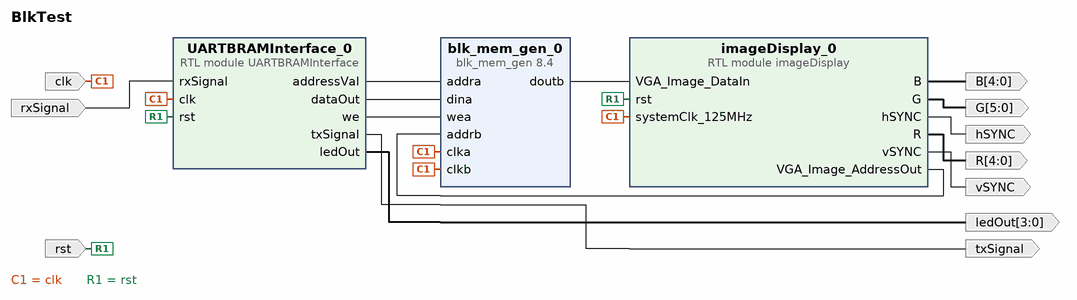
[diagram p0: block diagram of the top level]
# Vivado block design BlkTest, xc7z010clg400-1, Vivado 2019.1
create_bd_design BlkTest

create_bd_port -dir I clk
create_bd_port -dir I rst
create_bd_port -dir O -from 4 -to 0 R
create_bd_port -dir O -from 5 -to 0 G
create_bd_port -dir O -from 4 -to 0 B
create_bd_port -dir O hSYNC
create_bd_port -dir O vSYNC
create_bd_port -dir O txSignal
create_bd_port -dir I rxSignal
create_bd_port -dir O -from 3 -to 0 ledOut

create_bd_cell -type module -reference imageDisplay imageDisplay_0
create_bd_cell -type ip -vlnv xilinx.com:ip:blk_mem_gen:8.4 blk_mem_gen_0
set_property -dict [list \
  CONFIG.Enable_32bit_Address false \
  CONFIG.Enable_A Always_Enabled \
  CONFIG.Enable_B Always_Enabled \
  CONFIG.Memory_Type Simple_Dual_Port_RAM \
  CONFIG.Operating_Mode_A NO_CHANGE \
  CONFIG.Port_B_Clock 100 \
  CONFIG.Port_B_Enable_Rate 100 \
  CONFIG.Read_Width_B 8 \
  CONFIG.Register_PortB_Output_of_Memory_Primitives false \
  CONFIG.Use_Byte_Write_Enable false \
  CONFIG.Write_Depth_A 76800 \
  CONFIG.Write_Width_A 8 \
  CONFIG.Write_Width_B 8 \
  CONFIG.use_bram_block Stand_Alone \
] [get_bd_cells blk_mem_gen_0]
create_bd_cell -type module -reference UARTBRAMInterface UARTBRAMInterface_0

# ---- connections ----

connect_bd_net [get_bd_ports clk] \
  [get_bd_pins blk_mem_gen_0/clkb] [get_bd_pins blk_mem_gen_0/clka] [get_bd_pins imageDisplay_0/systemClk_125MHz] \
  [get_bd_pins UARTBRAMInterface_0/clk]
connect_bd_net [get_bd_ports rst] [get_bd_pins imageDisplay_0/rst] [get_bd_pins UARTBRAMInterface_0/rst]
connect_bd_net [get_bd_pins blk_mem_gen_0/doutb] [get_bd_pins imageDisplay_0/VGA_Image_DataIn]
connect_bd_net [get_bd_pins imageDisplay_0/VGA_Image_AddressOut] [get_bd_pins blk_mem_gen_0/addrb]
connect_bd_net [get_bd_pins imageDisplay_0/R] [get_bd_ports R]
connect_bd_net [get_bd_pins imageDisplay_0/G] [get_bd_ports G]
connect_bd_net [get_bd_pins imageDisplay_0/B] [get_bd_ports B]
connect_bd_net [get_bd_pins imageDisplay_0/hSYNC] [get_bd_ports hSYNC]
connect_bd_net [get_bd_pins imageDisplay_0/vSYNC] [get_bd_ports vSYNC]
connect_bd_net [get_bd_pins UARTBRAMInterface_0/txSignal] [get_bd_ports txSignal]
connect_bd_net [get_bd_ports rxSignal] [get_bd_pins UARTBRAMInterface_0/rxSignal]
connect_bd_net [get_bd_pins UARTBRAMInterface_0/ledOut] [get_bd_ports ledOut]
connect_bd_net [get_bd_pins UARTBRAMInterface_0/addressVal] [get_bd_pins blk_mem_gen_0/addra]
connect_bd_net [get_bd_pins UARTBRAMInterface_0/dataOut] [get_bd_pins blk_mem_gen_0/dina]
connect_bd_net [get_bd_pins UARTBRAMInterface_0/we] [get_bd_pins blk_mem_gen_0/wea]

validate_bd_design
save_bd_design
